# EAGLE design dp_tsc_com-v1.21 (EAGLE 6.6.0)
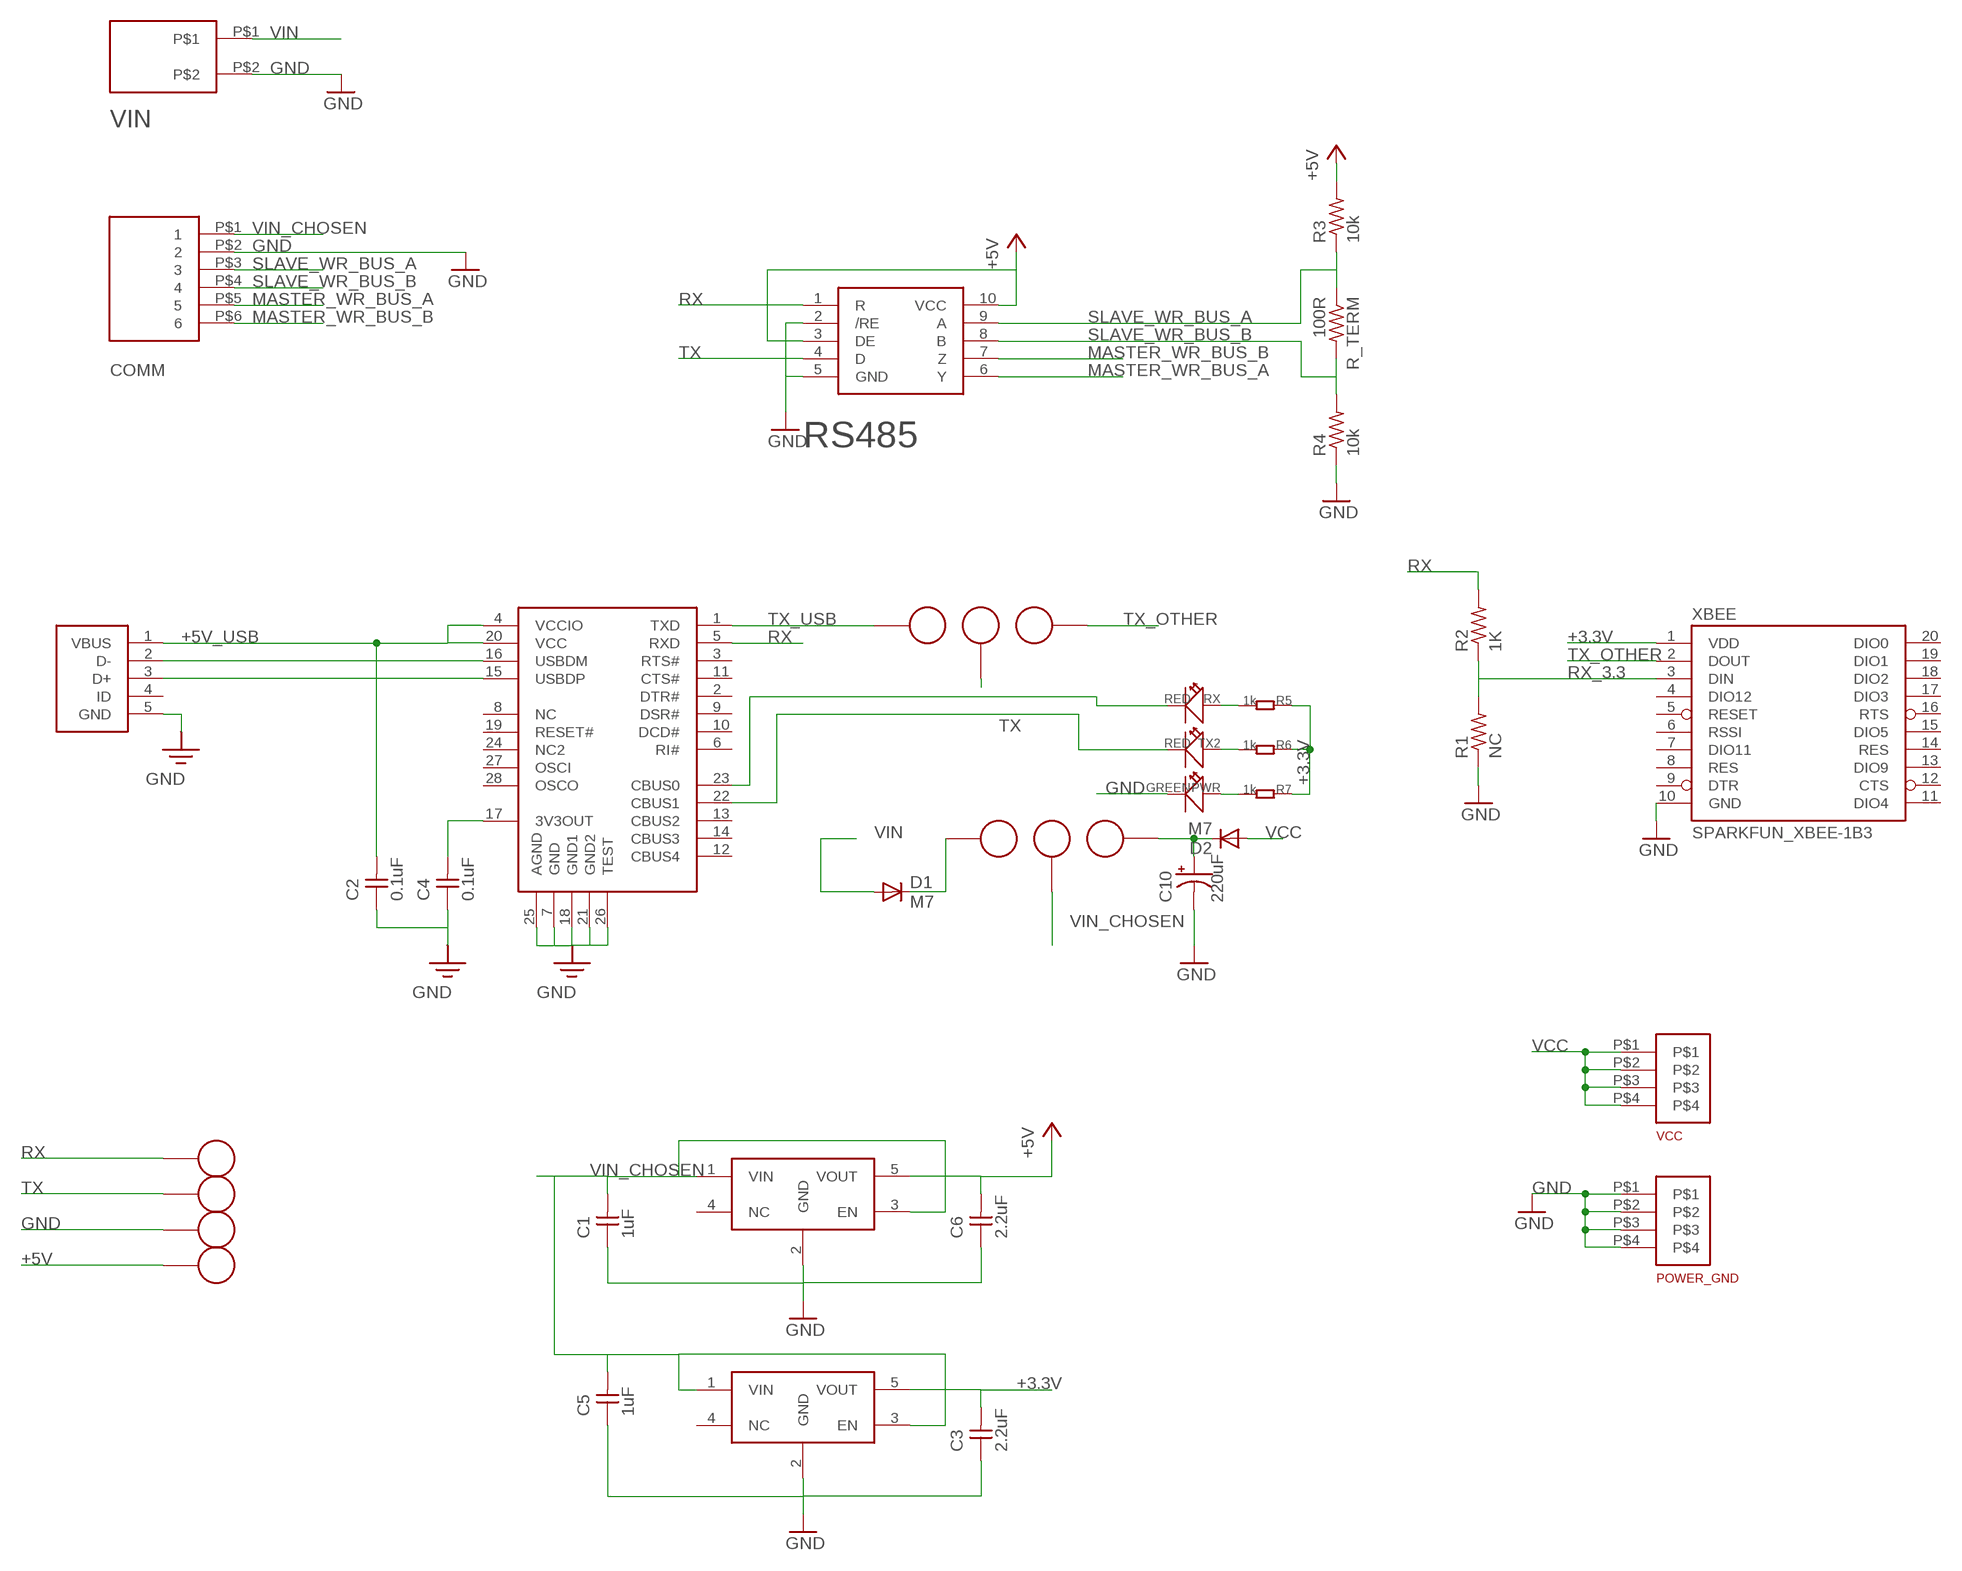
[diagram p0: schematic, sheet 1]

## Parts
3.3V_REG  MIC5235  [SOT-23-5]
5V1  CONNECTOR_TV  [CONNECTOR_TV]
5V_REG  MIC5235  [SOT-23-5]
5V_USB1  CONNECTOR_TV  [CONNECTOR_TV]
5V_VREG1  CONNECTOR_TV  [CONNECTOR_TV]
+5V  CONNECTOR_TV  [CONNECTOR_TV]
C1  1uF  CAPACITOR0805  [0805@1]
C2  0.1uF  CAPACITOR0805  [0805@1]
C3  2.2uF  CAPACITOR0805  [0805@1]
C4  0.1uF  CAPACITOR0805  [0805@1]
C5  1uF  CAPACITOR0805  [0805@1]
C6  2.2uF  CAPACITOR0805  [0805@1]
C10  220uF  CAP-EMVY350ADA221MHA0G  [HAO]
COMM  6PIN-RIBBONCABLE-BOARDHEADER  [6PIN-HEADER-DUALROW]
D1  M7  DIODE-DO214BA  [DO214BA]
D2  M7  DIODE-DO214BA  [DO214BA]
FT323R  FT232R  [SSOP-28]
GND  CONNECTOR_TV  [CONNECTOR_TV]
POWER_GND  SCREW_TERMINAL_7700K  [SCREW_TERM_7700K]
PWR  GREEN  LED0603_SS  [LED0603_S]
R1  NC  RESISTOR0603  [0603]
R2  1K  RESISTOR0603  [0603]
R3  10k  RESISTOR0603  [0603]
R4  10k  RESISTOR0603  [0603]
R5  1k  R0603_S  [0603_S]
R6  1k  R0603_S  [0603_S]
R7  1k  R0603_S  [0603_S]
R_TERM  100R  RESISTOR0603  [0603]
RS485  RS485-SN65HVD3086EDGSR  [MSOP-10]
RX  RED  LED0603_SS  [LED0603_S]
RX1  CONNECTOR_TV  [CONNECTOR_TV]
TX  CONNECTOR_TV  [CONNECTOR_TV]
TX1  CONNECTOR_TV  [CONNECTOR_TV]
TX2  RED  LED0603_SS  [LED0603_S]
TX_FTDI  CONNECTOR_TV  [CONNECTOR_TV]
TX_TTL  CONNECTOR_TV  [CONNECTOR_TV]
USB  MINIUSB  [UX60-MINI-USB]
VCC  SCREW_TERMINAL_7700K  [SCREW_TERM_7700K]
VIN  2PIN-3.81MM-TERMINAL-BLOCK  [2PIN-TERMINAL-BLOCK-SMALLER]
XBEE  SPARKFUN_XBEE-1B3  [SPARKFUN_XBEE-SMD]

## Nets
+3.3V: 3.3V_REG.5(VOUT) C3.2 R5.1 R6.1 R7.1 XBEE.1(VDD)
+5V: 5V_REG.5(VOUT) +5V.P$1 C6.2 R3.2 RS485.3(DE) RS485.10(VCC)
+5V_USB: C2.2 FT323R.4(VCCIO) FT323R.20(VCC) USB.1(VBUS)
D+: FT323R.15(USBDP) USB.3(D+)
D-: FT323R.16(USBDM) USB.2(D-)
GND: 3.3V_REG.2(GND) 5V_REG.2(GND) C1.1 C2.1 C3.1 C4.1 C5.1 C6.1 C10.- COMM.P$2 FT323R.7(GND) FT323R.18(GND1) FT323R.21(GND2) FT323R.25(AGND) FT323R.26(TEST) GND.P$1 POWER_GND.P$1 POWER_GND.P$2 POWER_GND.P$3 POWER_GND.P$4 PWR.2(-) R1.1 R4.1 RS485.2(/RE) RS485.5(GND) USB.5(GND) VIN.P$2 XBEE.10(GND)
MASTER_WR_BUS_A: COMM.P$5 RS485.6(Y)
MASTER_WR_BUS_B: COMM.P$6 RS485.7(Z)
N$1: 5V_USB1.P$1 C10.+ D2.C
N$2: R6.2 TX2.1(+)
N$3: R5.2 RX.1(+)
N$4: C4.2 FT323R.17(3V3OUT)
N$5: PWR.1(+) R7.2
N$6: 5V_VREG1.P$1 D1.C
RX: FT323R.5(RXD) R2.2 RS485.1(R) RX1.P$1
RX_3.3: R1.2 R2.1 XBEE.3(DIN)
RXING: FT323R.23(CBUS0) RX.2(-)
SLAVE_WR_BUS_A: COMM.P$3 R3.1 R_TERM.1 RS485.9(A)
SLAVE_WR_BUS_B: COMM.P$4 R4.2 R_TERM.2 RS485.8(B)
TX: RS485.4(D) TX1.P$1 TX.P$1
TX_OTHER: TX_TTL.P$1 XBEE.2(DOUT)
TX_USB: FT323R.1(TXD) TX_FTDI.P$1
TXING: FT323R.22(CBUS1) TX2.2(-)
VCC: D2.A VCC.P$1 VCC.P$2 VCC.P$3 VCC.P$4
VIN: D1.A VIN.P$1
VIN_CHOSEN: 3.3V_REG.1(VIN) 3.3V_REG.3(EN) 5V1.P$1 5V_REG.1(VIN) 5V_REG.3(EN) C1.2 C5.2 COMM.P$1
Unconnected: 3.3V_REG.4(NC) 5V_REG.4(NC) FT323R.2(DTR#) FT323R.3(RTS#) FT323R.6(RI#) FT323R.8(NC) FT323R.9(DSR#) FT323R.10(DCD#) FT323R.11(CTS#) FT323R.12(CBUS4) FT323R.13(CBUS2) FT323R.14(CBUS3) FT323R.19(RESET#) FT323R.24(NC2) FT323R.27(OSCI) FT323R.28(OSCO) USB.4(ID) XBEE.4(DIO12) XBEE.5(RESET) XBEE.6(RSSI) XBEE.7(DIO11) XBEE.8(RES) XBEE.9(DTR) XBEE.11(DIO4) XBEE.12(CTS) XBEE.13(DIO9) XBEE.14(RES) XBEE.15(DIO5) XBEE.16(RTS) XBEE.17(DIO3) XBEE.18(DIO2) XBEE.19(DIO1) XBEE.20(DIO0)

## Library data of the parts
3.3V_REG 5V_REG = soa:MIC5235
5V1 5V_USB1 5V_VREG1 +5V GND RX1 TX TX1 TX_FTDI TX_TTL = soa:CONNECTOR_TV
C1-C6 = huggable:CAPACITOR
C10 = soa:CAP-EMVY350ADA221MHA0G
COMM = soa:6PIN-RIBBONCABLE-BOARDHEADER
D1 D2 = diode:DIODE-: DIODE
FT323R = ftdi:FT232R
POWER_GND VCC = soa:SCREW_TERMINAL_7700K
PWR RX TX2 = CPT_SMD:LED0603
R1-R4 R_TERM = huggable:RESISTOR
R5-R7 = CPT_SMD:R0603
RS485 = soa:RS485-SN65HVD3086EDGSR
USB = usb:MINIUSB
VIN = soa:2PIN-3.81MM-TERMINAL-BLOCK
XBEE = XBee-Explorer-v15:SPARKFUN_XBEE-1

## Net classes
0 default: width 0.203 mm, drill 0.305 mm, clearance 0.152 mm

## Board
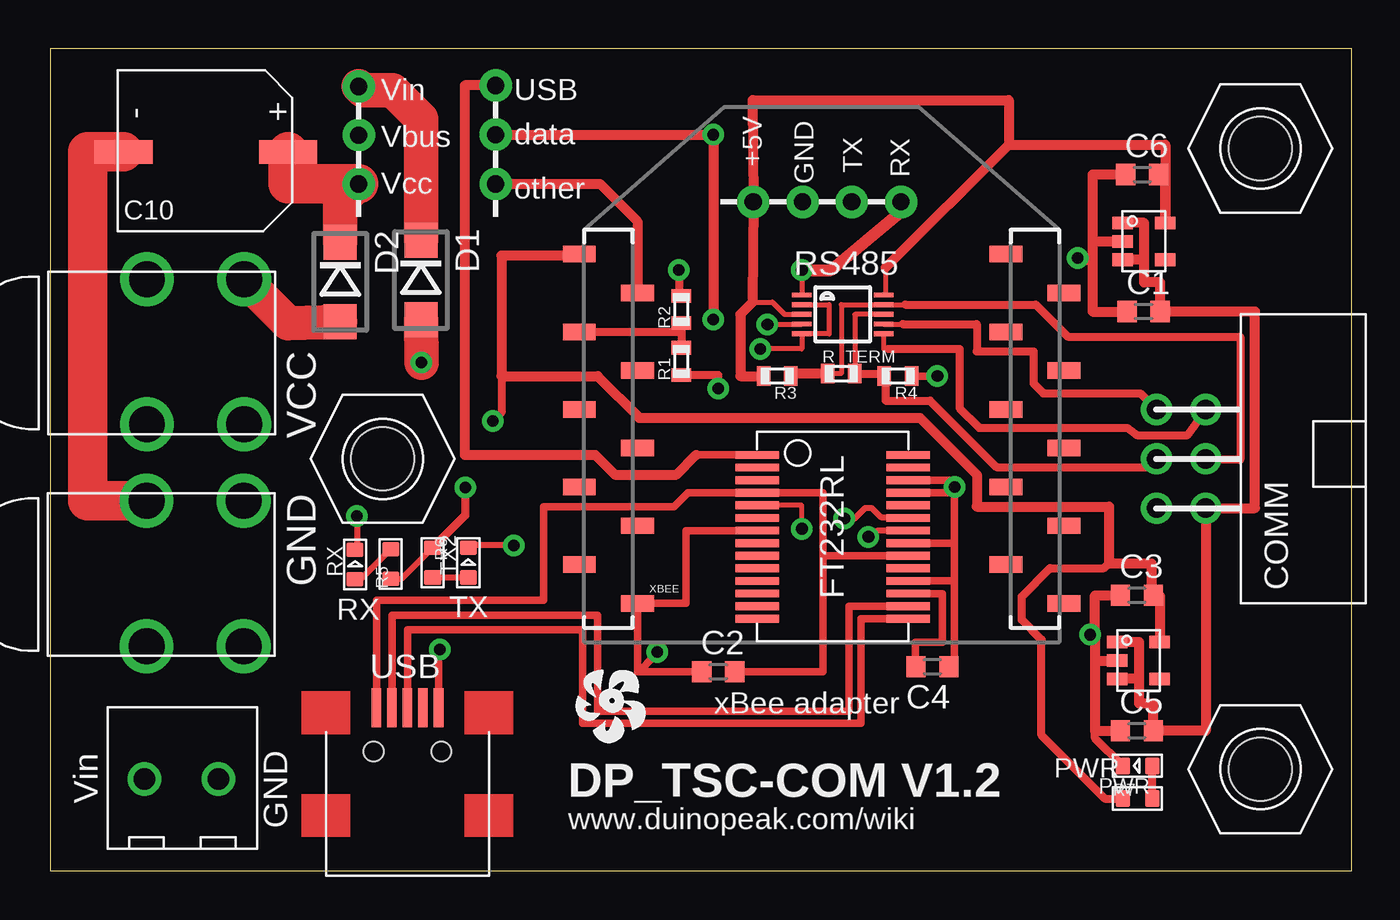
[diagram p1: board, top side]
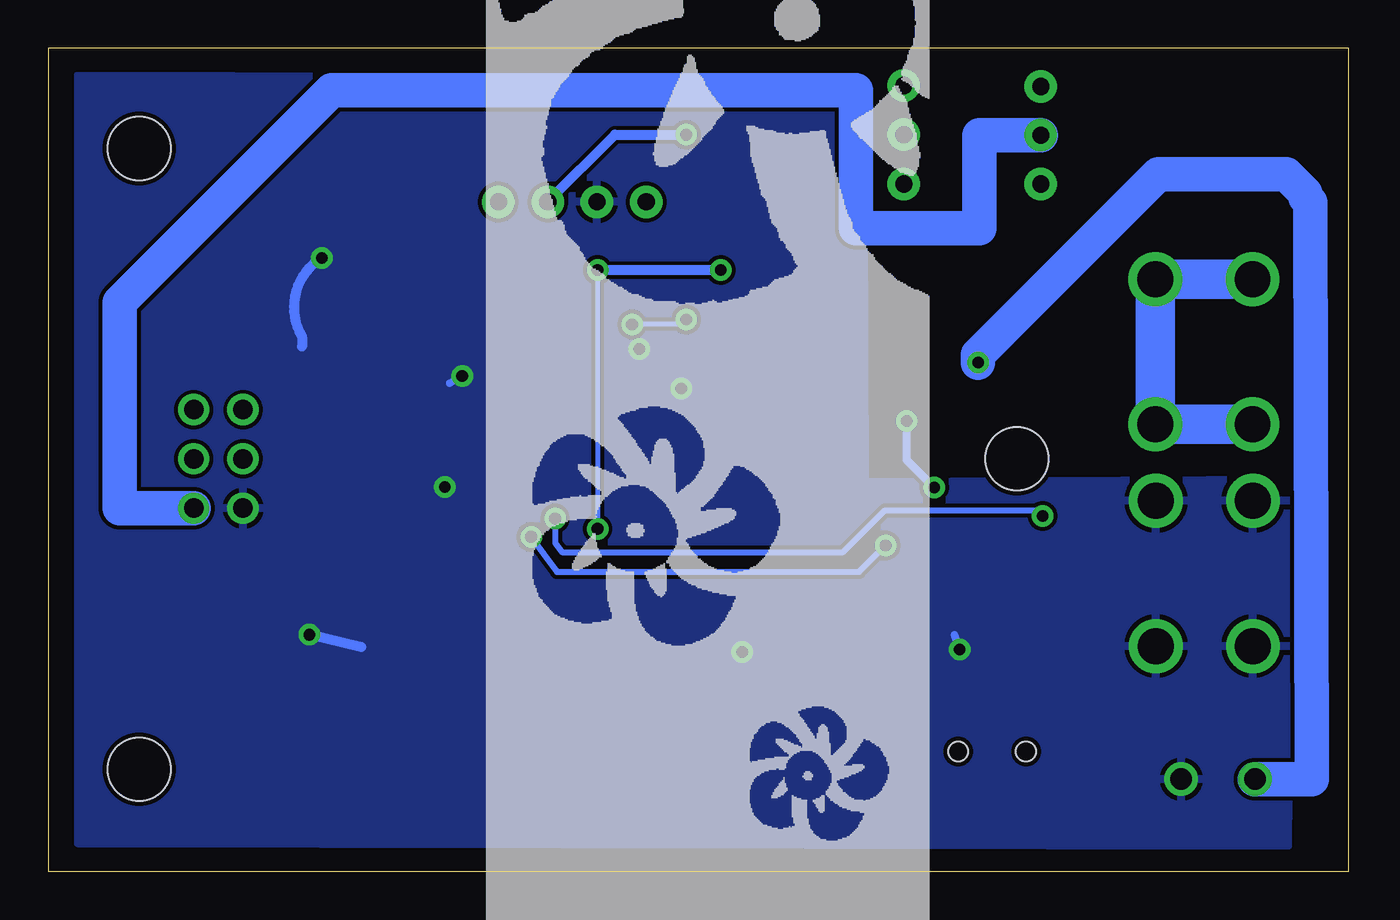
[diagram p2: board, bottom side, seen from below]

Size 67.06 x 42.42 mm. Coordinates in mm from the lower left corner, seen from the top.
Outline: 67.06,42.42 67.06,0 0,0 0,42.42 67.06,42.42
Copper layers (1*16): signal_top 0.035mm / dielectric 1.5mm / gnd 0.035mm
Design rules "Sparkfun": minimum track width 8mil, minimum drill 20mil, track to track 8mil, track to pad 8mil, pad to pad 8mil, via to via 8mil, smd to smd 8mil, copper to edge 10mil, drill to drill 8mil, minimum pad ring 12mil, minimum via ring 10mil, stop-mask expansion 4mil, vias tented up to drill 25mil, thermal gap 10mil

### Footprints (pad centres in the part's own frame; a part is rotated, then mirrored left to right if it is on the bottom)
SOT-23-5 = smd 0.65 x 1.06: 1 0,0; 2 0.95,0; 3 1.9,0; 4 1.9,2.2; 5 0,2.2
CONNECTOR_TV = drill 0.889 pad 1.676: P$1 0,0
0805@1 = smd 1 x 1.1: 1 -0.85,0; 2 0.85,0
HAO = smd 1.2 x 3: + 0,5; - 0,-3.5
6PIN-HEADER-DUALROW = drill 1: P$1 -2.54,0; P$2 -2.54,2.54; P$3 0,0; P$4 0,2.54; P$5 2.54,0; P$6 2.54,2.54
DO214BA = smd 1.8 x 1.7: A 2.05,0; C -2.05,0
SSOP-28 = smd 2.25 x 0.4: 1 0,0; 2 0,-0.65; 3 0,-1.3; 4 0,-1.95; 5 0,-2.6; 6 0,-3.25; 7 0,-3.9; 8 0,-4.55; 9 0,-5.2; 10 0,-5.85; 11 0,-6.5; 12 0,-7.15; 13 0,-7.8; 14 0,-8.45; 15 7.8,-8.45; 16 7.8,-7.8; 17 7.8,-7.15; 18 7.8,-6.5; 19 7.8,-5.85; 20 7.8,-5.2; 21 7.8,-4.55; 22 7.8,-3.9; 23 7.8,-3.25; 24 7.8,-2.6; 25 7.8,-1.95; 26 7.8,-1.3; 27 7.8,-0.65; 28 7.8,0
SCREW_TERM_7700K = drill 1.854: P$1 -3.81,2.032; P$2 3.683,2.032; P$3 -3.81,-2.972; P$4 3.683,-2.972
LED0603_S = smd 0.762 x 0.889: 1 -0.762,0; 2 0.762,0
0603 = smd 0.7 x 1: 1 -0.7,0; 2 0.7,0
0603_S = smd 0.762 x 0.889: 1 -0.762,0; 2 0.762,0
MSOP-10 = smd 0.25 x 1: 1 -0.88,-2.423; 2 -0.38,-2.423; 3 0.12,-2.423; 4 0.62,-2.423; 5 1.12,-2.423; 6 1.12,1.803; 7 0.62,1.803; 8 0.12,1.803; 9 -0.38,1.803; 10 -0.88,1.803
4-40_NUT_DRILL = hole 3.264: 0,0
UX60-MINI-USB = smd 0.5 x 2: 1 -1.6,2.25; 2 -0.8,2.25; 3 0,2.25; 4 0.8,2.25; 5 1.6,2.25 | hole 1.016: -1.75,0; 1.75,0
2PIN-TERMINAL-BLOCK-SMALLER = drill 1.1: P$1 0,0; P$2 3.81,0
SPARKFUN_XBEE-SMD = smd 1.7 x 0.85: 1 -12.5,20; 2 -9.5,18; 3 -12.5,16; 4 -9.5,14; 5 -12.5,12; 6 -9.5,10; 7 -12.5,8; 8 -9.5,6; 9 -12.5,4; 10 -9.5,2; 11 12.5,2; 12 9.5,4; 13 12.5,6; 14 9.5,8; 15 12.5,10; 16 9.5,12; 17 12.5,14; 18 9.5,16; 19 12.5,18; 20 9.5,20

### Placement (x,y rotation side)
3.3V_REG  54.99,11.81 270 top
5V1  15.88,37.95 270 top
5V_REG  55.27,33.43 270 top
5V_USB1  15.88,35.43 270 top
5V_VREG1  15.88,40.46 270 top
+5V  36.23,34.51 180 top
C1  56.36,28.85 0 top
C2  34.42,10.29 0 top
C3  56.01,14.22 0 top
C4  45.47,10.54 180 top
C5  56.01,7.24 0 top
C6  56.29,35.92 0 top
C10  7.24,37.08 270 top
COMM  59.56,21.26 90 top
D1  19.08,30.48 270 top
D2  14.92,30.38 270 top
FT323R  36.42,21.46 0 top
GND  38.77,34.51 180 top
POWER_GND  6.96,15.42 90 top
PWR  56.04,5.43 180 top
R1  32.51,26.29 90 top
R2  32.51,28.96 90 top
R3  37.47,25.53 180 top
R4  43.69,25.53 180 top
R5  17.53,15.84 90 top
R6  19.68,15.91 270 top
R7  56.04,3.75 0 top
R_TERM  40.77,25.65 0 top
RS485  41.15,28.83 270 top
RX  15.68,15.81 90 top
RX1  43.85,34.51 180 top
TX  22.94,37.97 270 top
TX1  41.31,34.51 180 top
TX2  21.53,15.91 90 top
TX_FTDI  22.94,40.51 270 top
TX_TTL  22.94,35.43 270 top
U$1  [DUINOFUN-LOGO-PCB-0.5]  30.7,6.57 90 top
U$2  [4-40_NUT_DRILL]  62.38,37.26 270 top
U$3  [4-40_NUT_DRILL]  17.11,21.26 270 top
U$5  [DUINOFUN-BIG-LOGO-3.0]  21.65,-11.05 0 top  (outside the outline)
U$14  [4-40_NUT_DRILL]  62.38,5.26 270 top
USB  18.39,6.17 0 top
VCC  6.99,26.85 90 top
VIN  4.83,4.75 0 top
XBEE  39.75,11.81 0 top

### Tracks (layer width: path | path; a pad name or v marks a point on that pad's centre or on a via)
+3.3V  (via drill 0.6)
  signal_top 0.305: R5.1 18.1,15.08 R6.1
  signal_top 0.406: 23.24,25.53 23.24,23.65 v22.8,23.21 | v21.37,19.78 21.37,18.35 R6.1 | 54.57,15.88 54.32,15.62 51.53,15.62 50.07,14.16 50.07,12.95 51.09,11.94 51.09,7.02 54.36,3.75 R7.1
  signal_top 0.508: 3.3V_REG.5 57.19,14.22 C3.2 56.77,14.22 56.77,15.88 54.57,15.88 54.57,18.8 47.75,18.8 47.75,20.45 44.83,23.37 30.35,23.37 28.19,25.53 23.24,25.53 23.24,31.75 27.25,31.75 XBEE.1
  gnd 0.406: v22.8,23.21 22.8,21.21 v21.37,19.78
+5V
  signal_top 0.254: 43.05,31.12 43.05,29.81 RS485.10 | RS485.3 37.84,28.71 37.21,29.34 36.2,29.34
  signal_top 0.508: C6.2 57.47,35.92 5V_REG.5 57.47,37.47 49.4,37.47 | R3.2 35.56,25.53 35.56,28.71 36.19,29.34 36.2,29.34 +5V.P$1 36.2,39.75 49.4,39.75 49.4,37.47 | 49.4,37.47 43.05,31.12
+5V_USB
  signal_top 0.381: 39.81,16.26 39.81,19.51 FT323R.4 32.85,19.51 32.13,18.8 25.4,18.8 25.4,13.97 16.79,13.97 USB.1 | 39.81,16.26 FT323R.20 | 39.81,16.26 39.81,10.29 C2.2
D+
  signal_top 0.381: FT323R.15 41.78,13.01 41.78,7.62 27.43,7.62 27.43,12.45 18.39,12.45 USB.3
D-
  signal_top 0.381: FT323R.16 41.15,13.66 41.15,8.26 28.19,8.26 28.19,13.21 17.59,13.21 USB.2
GND  (via drill 0.6)
  signal_top 0.254: RS485.2 40.13,29.21 40.13,27.71 RS485.5 38.73,26.92 v36.58,26.92
  signal_top 0.381: 30.35,10.29 C2.1 | FT323R.7 32.77,17.56 32.77,13.81 XBEE.10 30.25,10.29 30.35,10.29 | 46.61,16.91 46.61,14.96 | 46.61,14.96 FT323R.18 | 46.61,14.96 46.61,10.54 C4.1 | R4.1 v45.72,25.53 | FT323R.26 46.61,20.16 v46.61,19.81 | FT323R.25 46.61,19.51 v46.61,19.81 | 46.61,16.91 FT323R.21 | v46.61,19.81 46.61,16.91 | 30.35,10.29 v31.27,11.3 | USB.5 19.99,11.43 v20.07,11.43
  signal_top 0.406: R1.1 34.42,25.59 v34.42,24.89 | PWR.2 53.85,6.86 53.85,7.24
  signal_top 0.508: C3.1 53.85,14.22 53.85,12.13 | 53.85,10.86 3.3V_REG.2 | 53.85,12.13 53.85,10.86 | v53.59,12.19 53.85,12.13 | C6.1 53.72,35.92 53.72,32.48 | 53.72,32.48 5V_REG.2 | C1.1 53.72,28.85 53.72,31.5 | 53.72,32.48 53.72,31.5 | C5.1 53.85,7.24 53.85,10.86 | v52.96,31.62 52.96,31.5 53.72,31.5
  signal_top 2.032: POWER_GND.P$2 1.91,19.1 1.91,37.08 C10.-
  gnd 0.254: v36.58,26.92 36.7,27.05
  gnd 0.381: v45.72,25.53 46.35,25.15 | v46.61,19.81 46.86,19.81 | v31.27,11.3 31.15,11.3 31.59,11.37 | v20.07,11.43 20.32,12.19
  gnd 0.406: v34.42,24.89 34.67,24.89 34.67,25.02
  gnd 0.508: 50.93,11.56 v53.59,12.19 | v52.96,31.62 arc-90 53.98,27.56 53.98,27.05
  pour gnd: 65.56,41.02 65.56,1.45 3.1,1.32 2.92,20.19 24.96,20.07 25.02,40.89
MASTER_WR_BUS_A
  signal_top 0.254: RS485.6 42.95,26.92 43.18,26.92 | COMM.P$5 59.49,23.8
  signal_top 0.406: 43.18,26.92 46.86,26.92 46.86,23.88 47.88,22.86 55.5,22.86 56.01,22.48 58.62,22.48 COMM.P$5
MASTER_WR_BUS_B
  signal_top 0.254: RS485.7 43.93,28.21
  signal_top 0.406: 43.93,28.21 47.75,28.21 47.75,26.8 50.67,26.8 50.67,25.15 51.18,24.64 56.19,24.64 COMM.P$6
N$1
  signal_top 1.778: 15.84,35.4 5V_USB1.P$1 14.92,34.48 D2.C
  signal_top 2.032: C10.+ 12.24,35.43 5V_USB1.P$1
N$2
  signal_top 0.305: R6.2 TX2.1
N$3
  signal_top 0.305: RX.1 15.97,15.05 R5.2
N$4
  signal_top 0.381: FT323R.17 45.97,14.31 45.97,11.81 44.58,11.81 44.58,10.54 C4.2
N$5
  signal_top 0.406: R7.2 PWR.1
N$6
  signal_top 1.778: D1.C 19.08,38.8 17.62,40.26 16.08,40.26 5V_VREG1.P$1
RX  (via drill 0.6)
  signal_top 0.254: FT323R.5 38.73,18.86 v38.73,17.65 | v38.73,30.99 RS485.1
  signal_top 0.406: v32.38,30.99 32.38,29.66 R2.2
  signal_top 0.61: v38.73,30.99 40.23,30.99 43.81,33.97 43.81,34.48 RX1.P$1
  gnd 0.254: v38.73,30.99 v38.73,17.65
  gnd 0.508: v32.38,30.99 v38.73,30.99
RX_3.3
  signal_top 0.406: R1.2 R2.1 32.51,27.81 XBEE.3
RXING  (via drill 0.6)
  signal_top 0.305: 44.22,18.19 FT323R.23 44.18,18.26 42.8,18.26 42.32,18.73 42.01,18.73 41.47,18.19 v40.93,18.19 | v15.78,18.32 15.78,16.67 RX.2
  gnd 0.305: v15.78,18.32 16.07,18.61 23.91,18.61 26.07,16.45 40.58,16.45 40.93,16.92 v40.93,18.19
SLAVE_WR_BUS_A
  signal_top 0.254: R_TERM.1 40.77,25.65 40.77,29.21 RS485.9 44.07,29.21
  signal_top 0.406: 44.07,29.21 50.8,29.21 52.45,27.56 61.34,27.56 61.34,21.21 59.56,21.21 COMM.P$3
  signal_top 0.508: R_TERM.1 38.29,25.65 R3.1
SLAVE_WR_BUS_B
  signal_top 0.254: 42.99,25.65 R4.2 43.05,25.46 | RS485.8 41.47,28.71 R_TERM.2
  signal_top 0.406: COMM.P$4 56.59,20.83 48.77,20.83 45.34,24.26 43.05,24.26 43.05,25.46 | R_TERM.2 42.86,25.65 R4.2
TX  (via drill 0.6)
  signal_top 0.254: RS485.4 37.34,28.21 v36.96,28.19
  signal_top 0.508: v34.16,28.45 v34.16,37.97 33.88,37.97 TX.P$1
  gnd 0.254: v36.96,28.19 34.16,28.19 v34.16,28.45
  gnd 0.508: TX1.P$1 37.85,37.97 v34.16,37.97
TX_OTHER
  signal_top 0.508: XBEE.2 30.25,33.5 28.32,35.43 TX_TTL.P$1
TX_USB
  signal_top 0.381: 33.27,21.46 FT323R.1
  signal_top 0.508: 33.27,21.46 32.26,20.45 29.08,20.45 28.07,21.46 21.34,21.46 21.34,40.51 TX_FTDI.P$1
TXING  (via drill 0.6)
  signal_top 0.305: FT323R.22 42.65,17.56 v42.16,17.24 | v23.88,16.8 21.65,16.8 TX2.2
  gnd 0.305: v23.88,16.8 25.24,15.43 40.83,15.43 v42.16,17.24
VCC
  signal_top 1.778: D2.A 12.24,28.25 VCC.P$4
  gnd 2.032: VCC.P$1 VCC.P$3 VCC.P$4 VCC.P$2
VIN  (via drill 0.6 pad 0.3)
  signal_top 1.778: D1.A v19.11,26.23
  gnd 1.778: VIN.P$1 1.91,4.75 1.97,34.49 2.22,34.75 2.22,34.96 3.21,35.94 9.81,35.94 19.11,26.64 v19.11,26.23
VIN_CHOSEN
  signal_top 0.508: 5V_REG.1 56.39,33.43 56.39,31.53 | 56.39,31.53 5V_REG.3 | 56.39,31.53 56.39,30.35 57.21,30.35 C1.2 62.1,28.85 62.1,18.72 COMM.P$1 59.56,7.24 C5.2 56.86,8.64 56.13,8.64 56.13,9.91 | 3.3V_REG.1 56.13,11.81 56.13,9.91 | 56.13,9.91 3.3V_REG.3
  gnd 0.508: 52.45,40.26 57.78,34.93
  gnd 1.778: 5V1.P$1 19.05,37.95 19.05,33.15 25.4,33.15 25.4,40.26 52.45,40.26 63.37,29.34 63.37,18.72 COMM.P$1

### Text on the board
tPlace: Vin | USB | +5V | GND | TX | RX | Vbus | data | Vcc | other | VCC | GND | RX | TX | xBee adapter | Vin | GND | PWR | DP_TSC-COM V1.2 | www.duinopeak.com/wiki
Document: v1.12:change tx from tx_other to tx(data)